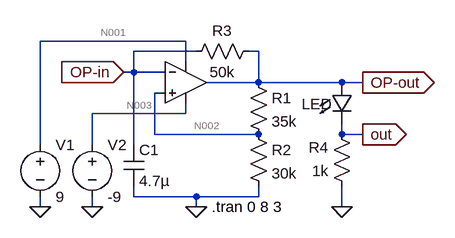
[diagram p0: schematic Init_Model_Op.asc]
Init_Model_Op.asc, the LTspice schematic file:
Version 4
SHEET 1 880 680
WIRE 224 128 0 128
WIRE 240 144 144 144
WIRE 336 144 320 144
WIRE 224 160 224 128
WIRE 144 176 144 144
WIRE 144 176 128 176
WIRE 192 176 144 176
WIRE 336 192 336 144
WIRE 336 192 256 192
WIRE 464 192 336 192
WIRE 496 192 464 192
WIRE 192 208 176 208
WIRE 224 240 224 224
WIRE 224 240 80 240
WIRE 176 272 176 208
WIRE 336 272 176 272
WIRE 464 272 464 256
WIRE 496 272 464 272
WIRE 0 288 0 128
WIRE 80 288 80 240
WIRE 144 288 144 176
WIRE 144 368 144 352
WIRE 240 368 144 368
WIRE 336 368 336 352
WIRE 336 368 240 368
WIRE 0 384 0 368
WIRE 80 384 80 368
WIRE 240 384 240 368
WIRE 464 384 464 352
FLAG 240 384 0
FLAG 0 384 0
FLAG 80 384 0
FLAG 464 384 0
FLAG 496 272 out
IOPIN 496 272 Out
FLAG 496 192 OP-out
IOPIN 496 192 Out
FLAG 128 176 OP-in
IOPIN 128 176 In
SYMBOL OpAmps\\LM741 224 128 R0
WINDOW 0 16 32 Invisible 2
WINDOW 3 16 96 Invisible 2
SYMATTR InstName U1
SYMBOL res 320 176 R0
SYMATTR InstName R1
SYMATTR Value 35k
SYMBOL res 320 256 R0
SYMATTR InstName R2
SYMATTR Value 30k
SYMBOL res 336 128 R90
WINDOW 0 0 56 VBottom 2
WINDOW 3 32 56 VTop 2
SYMATTR InstName R3
SYMATTR Value 50k
SYMBOL cap 128 288 R0
SYMATTR InstName C1
SYMATTR Value 4.7µ
SYMBOL voltage 0 272 R0
SYMATTR InstName V1
SYMATTR Value 9
SYMBOL voltage 80 272 R0
SYMATTR InstName V2
SYMATTR Value -9
SYMBOL LED 448 192 R0
WINDOW 0 -46 33 Left 2
WINDOW 3 24 64 Invisible 2
SYMATTR InstName LED
SYMATTR Value AOT-2015
SYMATTR Description Diode
SYMATTR Type diode
SYMBOL res 480 368 R180
WINDOW 0 36 76 Left 2
WINDOW 3 36 40 Left 2
SYMATTR InstName R4
SYMATTR Value 1k
TEXT 264 384 Left 2 !.tran 0 8 3

The netlist it stands for:
* Init_Model_Op.asc
XU1 N002 OP-in N001 N003 OP-out LM741  ; pins In+ In- V+ V- OUT
R1 OP-out N002 35k
R2 N002 0 30k
R3 OP-out OP-in 50k
C1 OP-in 0 4.7µ
V1 N001 0 9
V2 N003 0 -9
D§LED OP-out out AOT-2015
R4 0 out 1k
.model D D
.lib standard.dio
.tran 0 8 3
.lib LM741.lib
.backanno
.end

* Results of the author's LTspice run, read from the files saved beside the schematic
* Operating Point, zero values left out:
*   V(op-in) = 4.487 mV
*   V(n002) = 3.487 mV
*   V(n003) = -9 V
*   V(n001) = 9 V
*   V(op-out) = 9.58 mV
*   V(out) = 36.57 nV
*   I(Led) = 36.57 pA
*   I(R4) = -36.57 pA
*   I(R3) = 101.9 nA
*   I(R2) = 116.2 nA
*   I(R1) = 174.1 nA
*   I(V2) = 1.551 mA
*   I(V1) = -1.551 mA
*   Ix(u1:1) = 57.86 nA
*   Ix(u1:2) = 101.9 nA
*   Ix(u1:99) = 1.551 mA
*   Ix(u1:50) = -1.551 mA
*   Ix(u1:28) = -276 nA
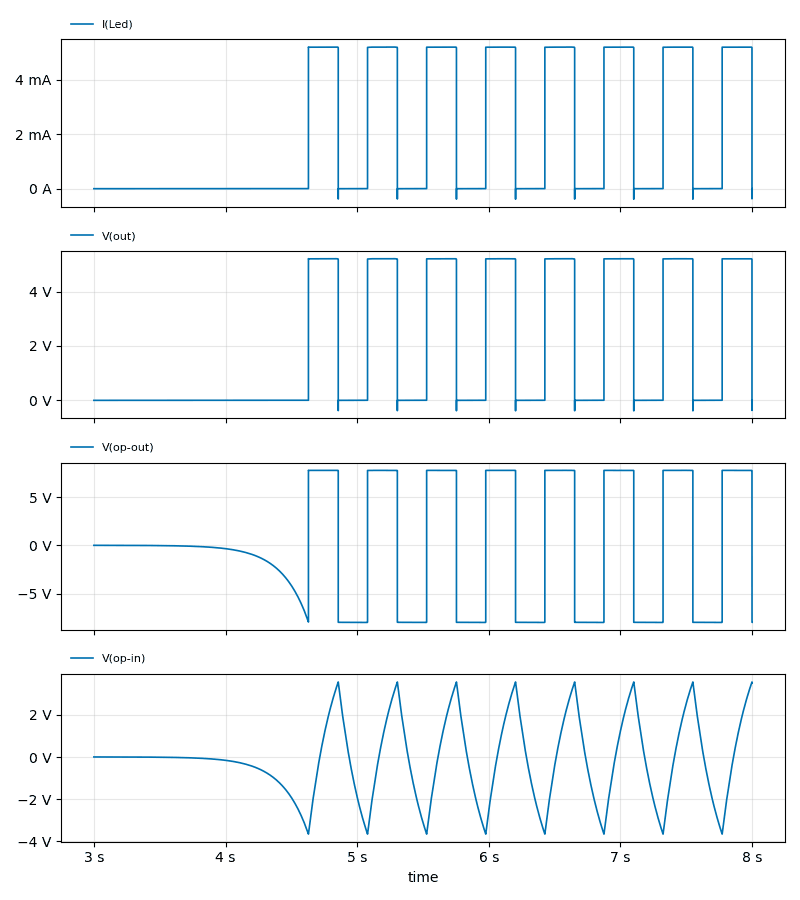
[diagram p1: Transient Analysis of Init_Model_Op.asc, plotted from the saved traces]
* Transient Analysis, 1 run:
*   I(Led): min -385.3 µA, max 5.207 mA, average 1.885 mA, rms 3.132 mA, last -619.9 pA
*   V(out): min -385.3 mV, max 5.207 V, average 1.885 V, rms 3.132 V, last -619.9 nV
*   V(op-out): min -7.994 V, max 7.785 V, average 12.23 mV, rms 6.564 V, last -7.979 V
*   V(op-in): min -3.66 V, max 3.563 V, average -143.5 mV, rms 1.872 V, last 3.516 V